# EAGLE schematic Custom_DUE (EAGLE 7.1.0)
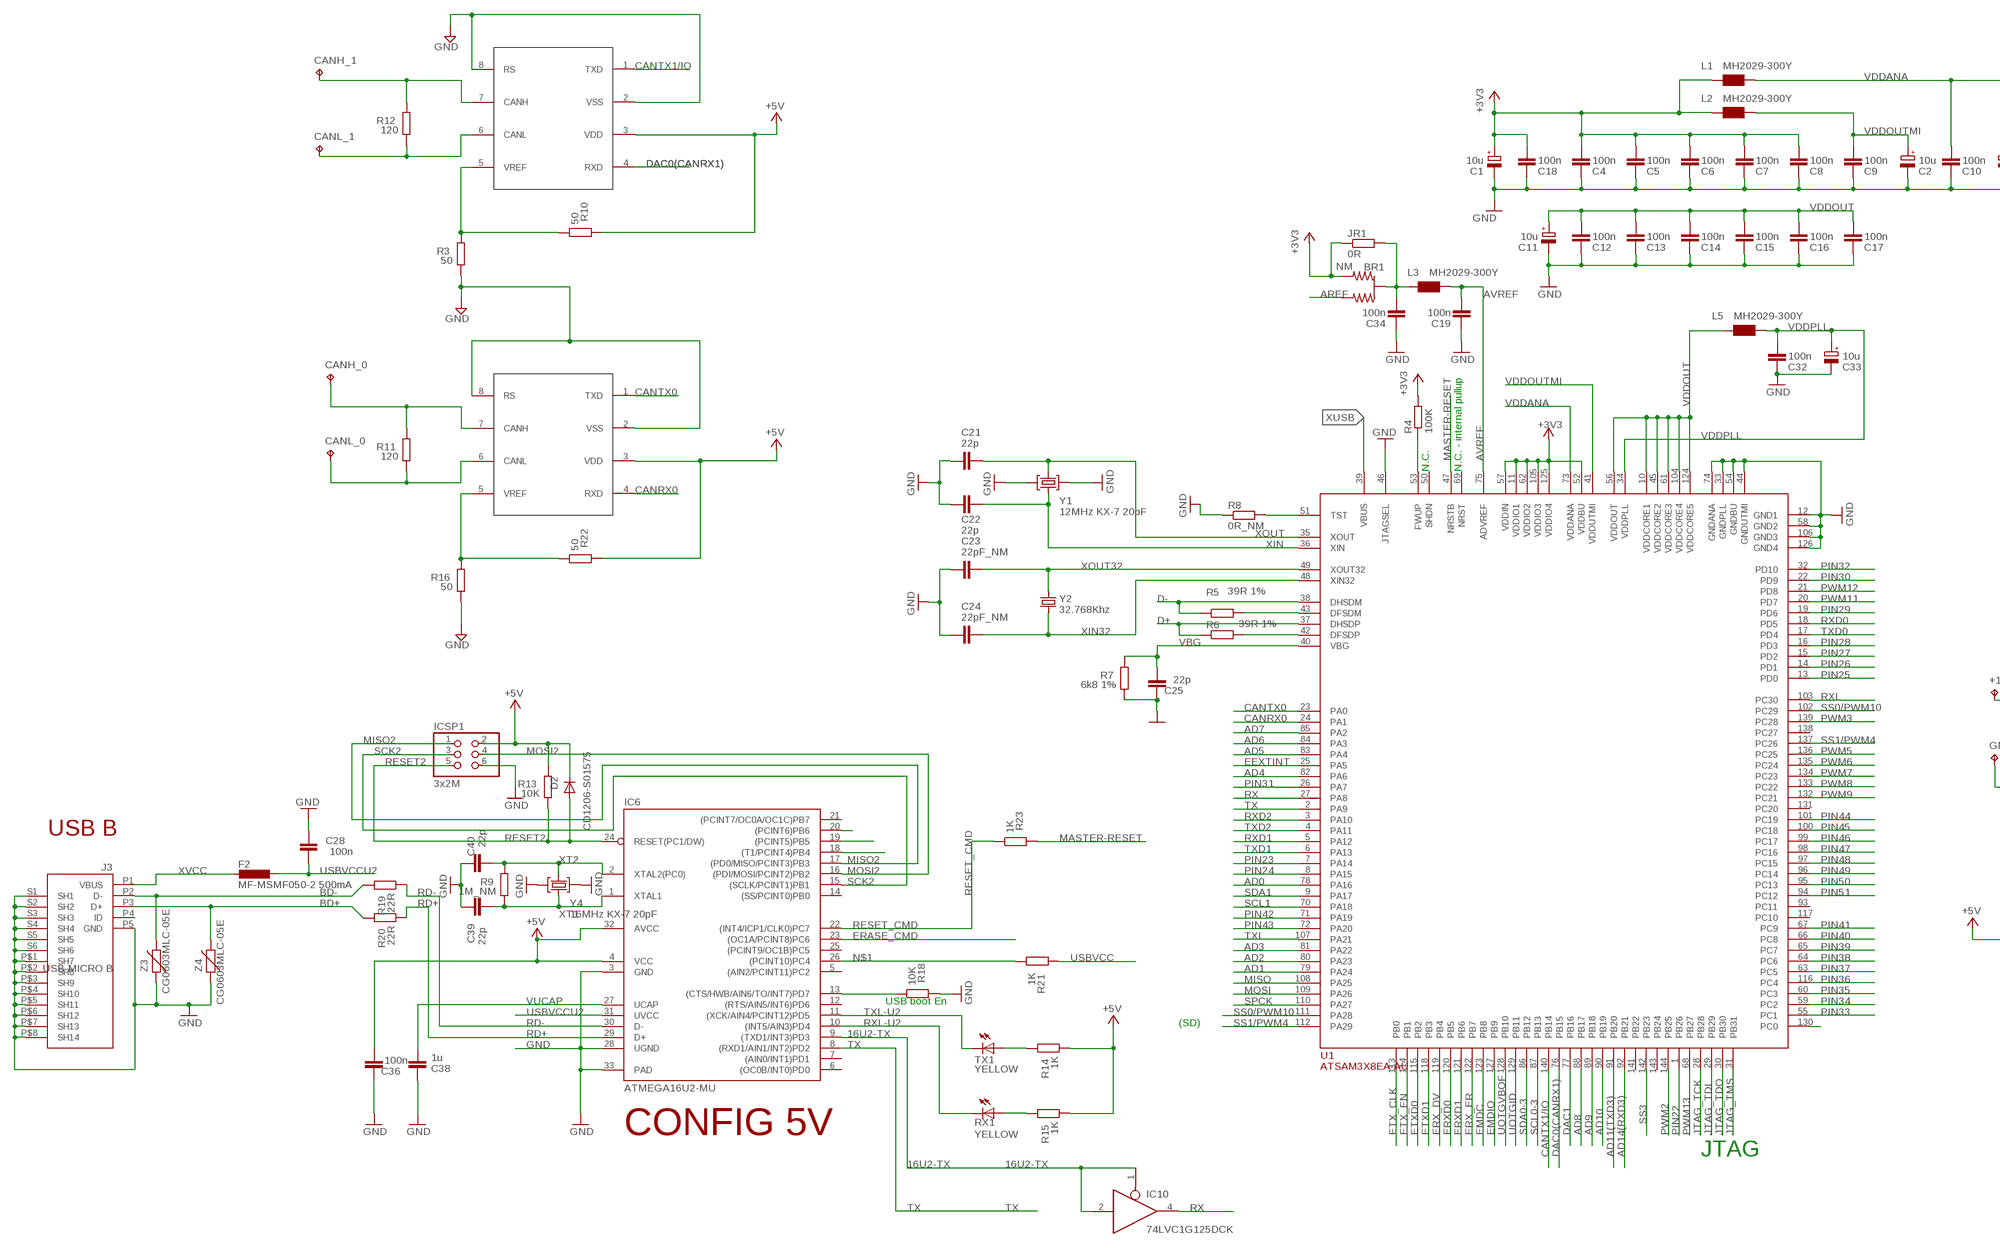
[diagram p0: schematic, sheet 1, part 1 of 2]
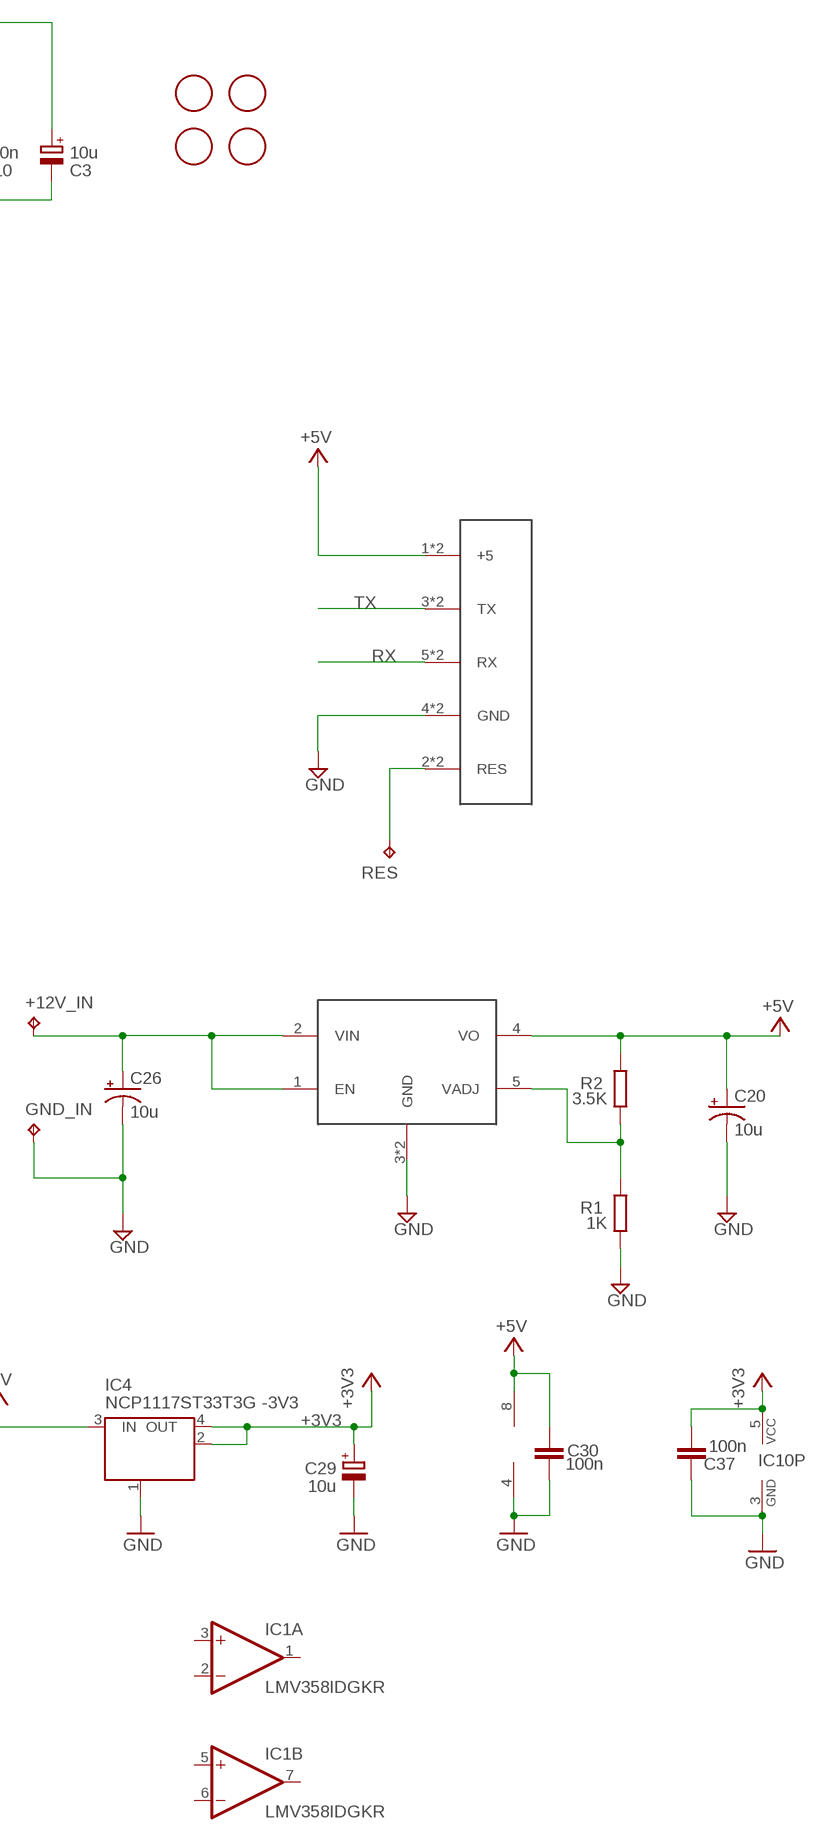
[diagram p1: schematic, sheet 1, part 2 of 2]

## Parts
+12V_IN  TPPAD1-20  [P1-20]
BR1  NM  J0402  [J0402]
C1  10u  CPOL-EUSMCB  [SMC_B]
C2  10u  CPOL-EUSMCB  [SMC_B]
C3  10u  CPOL-EUSMCB  [SMC_B]
C4  100n  C-EUC0402  [C0402]
C5  100n  C-EUC0402  [C0402]
C6  100n  C-EUC0402  [C0402]
C7  100n  C-EUC0402  [C0402]
C8  100n  C-EUC0402  [C0402]
C9  100n  C-EUC0402  [C0402]
C10  100n  C-EUC0402  [C0402]
C11  10u  CPOL-EUSMCB  [SMC_B]
C12  100n  C-EUC0402  [C0402]
C13  100n  C-EUC0402  [C0402]
C14  100n  C-EUC0402  [C0402]
C15  100n  C-EUC0402  [C0402]
C16  100n  C-EUC0402  [C0402]
C17  100n  C-EUC0402  [C0402]
C18  100n  C-EUC0402  [C0402]
C19  100n  C-EUC0402  [C0402]
C20  10u  CPOL-US153CLV-0405  [153CLV-0405]
C21  22p  C-EUC0402  [C0402]
C22  22p  C-EUC0402  [C0402]
C23  22pF_NM  C-EUC0402  [C0402]
C24  22pF_NM  C-EUC0402  [C0402]
C25  22p  C-EUC0402  [C0402]
C26  10u  CPOL-US153CLV-0405  [153CLV-0405]
C28  100n  C-EUC0402  [C0402]
C29  10u  CPOL-EUSMCB  [SMC_B]
C30  100n  C-EUC0402  [C0402]
C32  100n  C-EUC0402  [C0402]
C33  10u  CPOL-EUSMCB  [SMC_B]
C34  100n  C-EUC0402  [C0402]
C36  100n  C-EUC0402  [C0402]
C37  100n  C-EUC0402  [C0402]
C38  1u  C-EUC0402  [C0402]
C39  22p  C-EUC0402  [C0402]
C40  22p  C-EUC0402  [C0402]
CANH_0  TPPAD1-20  [P1-20]
CANH_1  TPPAD1-20  [P1-20]
CANL_0  TPPAD1-20  [P1-20]
CANL_1  TPPAD1-20  [P1-20]
D2  CD1206-S01575  DIODE-MINIMELF  [MINIMELF]
F2  MF-MSMF050-2 500mA  L-EUL1812  [L1812]
FID1  FIDUCIALMOUNT  [FIDUCIA-MOUNT]
FID2  FIDUCIALMOUNT  [FIDUCIA-MOUNT]
FID3  FIDUCIALMOUNT  [FIDUCIA-MOUNT]
FID4  FIDUCIALMOUNT  [FIDUCIA-MOUNT]
GND_IN  TPPAD1-20  [P1-20]
IC1  LMV358IDGKR  LMV358MMX  [MSOP08]
IC4  NCP1117ST33T3G -3V3  MC33269ST-3.3T3  [SOT223]
IC6  ATMEGA16U2-MU  [MLF32]
IC10  74LVC1G125DCK  [SC70-5]
ICSP1  3x2M  PINHD-2X3  [2X03]
J3  USB-MICRO B  MYCON2_USB-MINI-B  [CON2_USB_MICRO_B_AT]
JR1  0R  R-EU_R0402  [R0402]
L1  MH2029-300Y  WE-CBF_0805  [0805]
L2  MH2029-300Y  WE-CBF_0805  [0805]
L3  MH2029-300Y  WE-CBF_0805  [0805]
L5  MH2029-300Y  WE-CBF_0805  [0805]
R1  1K  R-EU_R0402  [R0402]
R2  3.5K  R-EU_R0402  [R0402]
R3  50  R-EU_R0402  [R0402]
R4  100K  R-EU_R0402  [R0402]
R5  39R 1%  R-EU_R0402  [R0402]
R6  39R 1%  R-EU_R0402  [R0402]
R7  6k8 1%  R-EU_R0603  [R0603-ROUND]
R8  0R_NM  R-EU_R0402  [R0402]
R9  1M_NM  R-EU_R0402  [R0402]
R10  50  R-EU_R0402  [R0402]
R11  120  R-EU_R0402  [R0402]
R12  120  R-EU_R0402  [R0402]
R13  10K  R-EU_R0402  [R0402]
R14  1K  R-EU_R0402  [R0402]
R15  1K  R-EU_R0402  [R0402]
R16  50  R-EU_R0402  [R0402]
R18  10K  R-EU_R0402  [R0402]
R19  22R  R-EU_R0402  [R0402]
R20  22R  R-EU_R0402  [R0402]
R21  1K  R-EU_R0402  [R0402]
R22  50  R-EU_R0402  [R0402]
R23  1K  R-EU_R0402  [R0402]
RES  TPPAD1-20  [P1-20]
RX1  YELLOW  LEDCHIP-LED0805  [CHIP-LED0805]
TX1  YELLOW  LEDCHIP-LED0805  [CHIP-LED0805]
U1  ATSAM3X8EA-AU  ATSAM3X/AAU  [LQFP144]
U2  MCP2551  [SOIC8]
U4  MCP2551  [SOIC8]
U$1  TLF1963TBATMA1  TLF1963  [DPAK]
U$3  LCD_DISPLAY  [FE05-2]
Y1  12MHz KX-7 20pF  CRYSTAL-3.2-2.5  [CRYSTAL-3.2-2.5]
Y2  32.768Khz  RESONATOR_EPSON_FC_145  [RESONATOR_EPSON_FC_145]
Y4  16MHz KX-7 20pF  CRYSTAL-3.2-2.5  [CRYSTAL-3.2-2.5]
Z3  CG0603MLC-05E  VARISTORCN0603  [CT/CN0603]
Z4  CG0603MLC-05E  VARISTORCN0603  [CT/CN0603]

## Nets
8PB4: IC6.18((T1/PCINT4)PB4)
8PB5: IC6.19((PCINT5)PB5)
8PB6: IC6.20((PCINT6)PB6)
16U2-TX: IC6.9((TXD1/INT3)PD3) IC10.1(OE) IC10.2(I)
+3V3: BR1.3 C1.+ C4.2 C5.2 C6.2 C7.2 C8.2 C18.2 C29.+ C37.1 IC4.2(OUT) IC4.4(OUT) IC10.5(VCC) JR1.1 L1.1 L2.1 R4.2 U1.11(VDDIO1) U1.52(VDDBU) U1.57(VDDIN) U1.62(VDDIO2) U1.105(VDDIO3) U1.125(VDDIO4)
+5V: C20.+ C30.2 C36.1 D2.C IC1.8(P:V+) IC4.3(IN) IC6.4(VCC) IC6.32(AVCC) ICSP1.2 R2.2 R10.2 R13.2 R14.1 R15.1 R22.2 U2.3(VDD) U4.3(VDD) U$1.4(VO) U$3.1(+5) U$3.10(+5)
AD0: U1.78(PA16)
AD1: U1.79(PA24)
AD2: U1.80(PA23)
AD3: U1.81(PA22)
AD4: U1.82(PA6)
AD5: U1.83(PA4)
AD6: U1.84(PA3)
AD7: U1.85(PA2)
AD8: U1.88(PB17)
AD9: U1.89(PB18)
AD10: U1.90(PB19)
AD11(TXD3): U1.91(PB20)
AD14(RXD3): U1.92(PB21)
AREF: BR1.1
AVREF: C19.2 L3.2 U1.75(ADVREF)
AVREFL: BR1.2(C) C34.2 JR1.2 L3.1
BD+ [USB]: J3.P3(D+) R20.2 Z4.2
BD- [USB]: J3.P2(D-) R19.2 Z3.2
CANRX0: U1.24(PA1) U4.4(RXD)
CANTX0: U1.23(PA0) U4.1(TXD)
CANTX1/IO: U1.140(PB14) U2.1(TXD)
D+ [USBpair]: R6.1 U1.37(DHSDP)
D- [USBpair]: R5.1 U1.38(DHSDM)
DAC0(CANRX1): U1.76(PB15) U2.4(RXD)
DAC1: U1.77(PB16)
DTR: IC6.13((CTS/HWB/AIN6/TO/INT7)PD7) R18.1
EEXTINT: U1.25(PA5)
EMDC: U1.123(PB8)
EMDIO: U1.127(PB9)
ERASE_CMD: IC6.23((OC1A/PCINT8)PC6)
ERASE_S: U1.130(PC0)
ERX_DV: U1.119(PB4)
ERX_ER: U1.122(PB7)
ERXD0: U1.120(PB5)
ERXD1: U1.121(PB6)
ETX_CLK: U1.113(PB0)
ETX_EN: U1.114(PB1)
ETXD0: U1.115(PB2)
ETXD1: U1.118(PB3)
GND: C1.- C2.- C3.- C4.1 C5.1 C6.1 C7.1 C8.1 C9.1 C10.1 C11.- C12.1 C13.1 C14.1 C15.1 C16.1 C17.1 C18.1 C19.1 C20.- C21.2 C22.2 C23.2 C24.2 C25.2 C26.- C28.2 C29.- C30.1 C32.1 C33.- C34.1 C36.2 C37.2 C38.2 C39.2 C40.2 GND_IN.TP IC1.4(P:V-) IC4.1(GND/ADJ) IC6.3(GND) IC6.28(UGND) IC6.33(PAD) IC10.3(GND) ICSP1.6 J3.P5(GND) J3.P$1(SH7) J3.P$2(SH8) J3.P$3(SH9) J3.P$4(SH10) J3.P$5(SH11) J3.P$6(SH12) J3.P$7(SH13) J3.P$8(SH14) J3.S1(SH1) J3.S2(SH2) J3.S3(SH3) J3.S4(SH4) J3.S5(SH5) J3.S6(SH6) R1.1 R3.1 R7.1 R8.1 R16.1 R18.2 U1.12(GND1) U1.33(GNDPLL) U1.44(GNDUTMI) U1.46(JTAGSEL) U1.54(GNDBU) U1.58(GND2) U1.74(GNDANA) U1.106(GND3) U1.126(GND4) U2.2(VSS) U2.8(RS) U4.2(VSS) U4.8(RS) U$1.3(GND) U$1.6(GND) U$3.4(GND) U$3.7(GND) Y1.2(GND) Y1.4(GND) Y4.2(GND) Y4.4(GND) Z3.1 Z4.1
JTAG_TCK: U1.28(PB28)
JTAG_TDI: U1.29(PB29)
JTAG_TDO: U1.30(PB30)
JTAG_TMS: U1.31(PB31)
MASTER-RESET: R23.2 U1.47(NRSTB)
MISO: U1.108(PA25)
MISO2: IC6.17((PD0/MISO/PCINT3)PB3) ICSP1.1
MOSI: U1.109(PA26)
MOSI2: IC6.16((PDI/MOSI/PCINT2)PB2) ICSP1.4
N$1: IC6.26((PCINT10)PC4) R21.1
N$2: +12V_IN.TP C26.+ U$1.1(EN) U$1.2(VIN)
N$3: R3.2 R10.1 U2.5(VREF)
N$4: R15.2 RX1.A
N$5: R8.2 U1.51(TST)
N$6: R1.2 R2.1 U$1.5(VADJ)
N$7: R4.1 U1.53(FWUP)
N$8: R16.2 R22.1 U4.5(VREF)
N$9: CANH_0.TP R11.2 U4.7(CANH)
N$10: CANL_0.TP R11.1 U4.6(CANL)
N$11: R5.2 U1.43(DFSDM)
N$12: R6.2 U1.42(DFSDP)
N$13: CANH_1.TP R12.2 U2.7(CANH)
N$14: R14.2 TX1.A
N$15: CANL_1.TP R12.1 U2.6(CANL)
N$16: RES.TP U$3.2(RES) U$3.9(RES)
PIN22: U1.1(PB26)
PIN23: U1.7(PA14)
PIN24: U1.8(PA15)
PIN25: U1.13(PD0)
PIN26: U1.14(PD1)
PIN27: U1.15(PD2)
PIN28: U1.16(PD3)
PIN29: U1.19(PD6)
PIN30: U1.22(PD9)
PIN31: U1.26(PA7)
PIN32: U1.32(PD10)
PIN33: U1.55(PC1)
PIN34: U1.59(PC2)
PIN35: U1.60(PC3)
PIN36: U1.116(PC4)
PIN37: U1.63(PC5)
PIN38: U1.64(PC6)
PIN39: U1.65(PC7)
PIN40: U1.66(PC8)
PIN41: U1.67(PC9)
PIN42: U1.71(PA19)
PIN43: U1.72(PA20)
PIN44: U1.101(PC19)
PIN45: U1.100(PC18)
PIN46: U1.99(PC17)
PIN47: U1.98(PC16)
PIN48: U1.97(PC15)
PIN49: U1.96(PC14)
PIN50: U1.95(PC13)
PIN51: U1.94(PC12)
PWM2: U1.144(PB25)
PWM3: U1.139(PC28)
PWM5: U1.136(PC25)
PWM6: U1.135(PC24)
PWM7: U1.134(PC23)
PWM8: U1.133(PC22)
PWM9: U1.132(PC21)
PWM11: U1.20(PD7)
PWM12: U1.21(PD8)
PWM13: U1.68(PB27)
RD+: IC6.29(D+) R20.1
RD-: IC6.30(D-) R19.1
RESET2: D2.A IC6.24(RESET(PC1/DW)) ICSP1.5 R13.1
RESET_CMD: IC6.22((INT4/ICP1/CLK0)PC7) R23.1
RX: IC10.4(O) U1.27(PA8) U$3.5(RX) U$3.6(RX)
RXD0: U1.18(PD5)
RXD1: U1.5(PA12)
RXD2: U1.3(PA10)
RXL: U1.103(PC30)
RXL-U2: IC6.10((INT5/AIN3)PD4) RX1.C
SCK2: IC6.15((SCLK/PCINT1)PB1) ICSP1.3
SCL0-3: U1.87(PB13)
SCL1: U1.70(PA18)
SDA0-3: U1.86(PB12)
SDA1: U1.9(PA17)
SPCK: U1.110(PA27)
SS0/PWM10: U1.102(PC29) U1.111(PA28)
SS1/PWM4: U1.112(PA29) U1.137(PC26)
SS3: U1.142(PB23)
TX: IC6.8((RXD1/AIN1/INT2)PD2) U1.2(PA9) U$3.3(TX) U$3.8(TX)
TXD0: U1.17(PD4)
TXD1: U1.6(PA13)
TXD2: U1.4(PA11)
TXL: U1.107(PA21)
TXL-U2: IC6.11((XCK/AIN4/PCINT12)PD5) TX1.C
UOTGID: U1.129(PB11)
UOTGVBOF: U1.128(PB10)
USBVCC: R21.2
USBVCCU2: C28.1 F2.1 IC6.31(UVCC)
VBG: C25.1 R7.2 U1.40(VBG)
VDDANA: C3.+ C10.2 L1.2 U1.73(VDDANA)
VDDOUT: C11.+ C12.2 C13.2 C14.2 C15.2 C16.2 C17.2 L5.1 U1.10(VDDCORE1) U1.45(VDDCORE2) U1.56(VDDOUT) U1.61(VDDCORE3) U1.104(VDDCORE4) U1.124(VDDCORE5)
VDDOUTMI: C2.+ C9.2 L2.2 U1.41(VDDUTMI)
VDDPLL: C32.2 C33.+ L5.2 U1.34(VDDPLL)
VUCAP: C38.1 IC6.27(UCAP)
XIN: C22.1 U1.36(XIN) Y1.1(C1)
XIN32: C24.1 U1.48(XIN32) Y2.P$2
XOUT: C21.1 U1.35(XOUT) Y1.3(C2)
XOUT32: C23.1 U1.49(XOUT32) Y2.P$1
XT1: C39.1 IC6.1(XTAL1) R9.1 Y4.1(C1)
XT2: C40.1 IC6.2(XTAL2(PC0)) R9.2 Y4.3(C2)
XUSB [usbvcc]: U1.39(VBUS)
XVCC [usbvcc]: F2.2 J3.P1(VBUS)
Unconnected: IC1.1(A:OUT) IC1.2(A:-IN) IC1.3(A:+IN) IC1.5(B:+IN) IC1.6(B:-IN) IC1.7(B:OUT) IC6.5((AIN2/PCINT11)PC2) IC6.6((OC0B/INT0)PD0) IC6.7((AIN0/INT1)PD1) IC6.12((RTS/AIN5/INT6)PD6) IC6.14((SS/PCINT0)PB0) IC6.21((PCINT7/OC0A/OC1C)PB7) IC6.25((PCINT9/OC1B)PC5) J3.P4(ID) U1.50(SHDN) U1.69(NRST) U1.93(PC11) U1.117(PC10) U1.131(PC20) U1.138(PC27) U1.141(PB22) U1.143(PB24)

## Notes on the sheet
- N.C. | N.C. - internal pullup
- USB B
- USB boot En
- (SD)
- CONFIG 5V
- JTAG

## Library data of the parts
+12V_IN CANH_0 CANH_1 CANL_0 CANL_1 GND_IN RES = testpad:TP: Test pad
BR1 = bibaja:J: Three terminal jumper made from two 0402, 0603, 0805, etc.
C1-C3 C11 C29 C33 = rcl:CPOL-EU: POLARIZED CAPACITOR, European symbol
C4-C10 C12-C19 C21-C25 C28 C30 C32 C34 C36-C40 = SmartPrj:C-EU: CAPACITOR, European symbol
C20 C26 = Dash parts:CPOL-US: POLARIZED CAPACITOR, American symbol; EEE-FPV100UAR: 10u
D2 = diode:DIODE-: DIODE
F2 = rcl:L-EU: INDUCTOR, European symbol
FID1-FID4 = SmartPrj:FIDUCIALMOUNT
IC1 = linear:LMV358?*: Dual General Purpose, Low Voltage, Rail-to-Rail Output Operational Amplifiers Source: http://www.national.com/mpf/LM/LMV321.html http://www.national.com/dt/lmv_qual.pdf
IC4 = linear:MC33269ST*: Adjustable Output Low Dropout Voltage Regulator 800 mA Source: http://www.onsemi.com/pub/Collateral/MC33269-D.PDF
IC6 = SmartPrj:ATMEGA16U2-
IC10 = 74xx-little-us:74*1G125: Single Bus Buffer Gate with 3-State Output
ICSP1 = SmartPrj:PINHD-2X3: PIN HEADER
J3 = SmartPrj:MYCON2_USB-MINI-B
JR1 R3-R16 R18-R23 = SmartPrj:R-EU_: RESISTOR, European symbol
L1-L3 L5 = wuerth-elektronik:WE-CBF: SMD EMI Suppression Ferrite Beads - excellent anti-EMI properties - low DCR - impedances till 3000 ohms - rated current up to 6 A
R1 = SmartPrj:R-EU_: RESISTOR, European symbol; SMD: 1K, 1%
R2 = SmartPrj:R-EU_: RESISTOR, European symbol; SMD: 3.5K, 1%
RX1 TX1 = led:LED: LED OSRAM: - CHIPLED LG R971, LG N971, LY N971, LG Q971, LY Q971, LO R971, LY R971 LH N974, LH R974 LS Q976, LO Q976, LY Q976 LO Q996 - Hyper CHIPLED LW Q18S LB Q993, LB Q99A, LB R99A - SideLED LS A670, LO A670, LY A670, LG A670, LP A670 LB A673, LV A673, LT A673, LW A673 LH A674 LY A675 LS A676, LA A676, LO A676, LY A676, LW A676 LS A679, LY A679, LG A679 - Hyper Micro SIDELED® LS Y876, LA Y876, LO Y876, LY Y876 LT Y87S - SmartLED LW L88C, LW L88S LB L89C, LB L89S, LG L890 LS L89K, LO L89K, LY L89K LS L896, LA L896, LO L896, LY L896 - TOPLED LS T670, LO T670, LY T670, LG T670, LP T670 LSG T670, LSP T670, LSY T670, LOP T670, LYG T670 LG T671, LOG T671, LSG T671 LB T673, LV T673, LT T673, LW T673 LH T674 LS T676, LA T676, LO T676, LY T676, LB T676, LH T676, LSB T676, LW T676 LB T67C, LV T67C, LT T67C, LS T67K, LO T67K, LY T67K, LW E67C LS E67B, LA E67B, LO E67B, LY E67B, LB E67C, LV E67C, LT E67C LW T67C LS T679, LY T679, LG T679 LS T770, LO T770, LY T770, LG T770, LP T770 LB T773, LV T773, LT T773, LW T773 LH T774 LS E675, LA E675, LY E675, LS T675 LS T776, LA T776, LO T776, LY T776, LB T776 LHGB T686 LT T68C, LB T68C - Hyper Mini TOPLED® LB M676 - Mini TOPLED Santana® LG M470 LS M47K, LO M47K, LY M47K Source: http://www.osram.convergy.de LUXEON: - LUMILED® LXK2-PW12-R00, LXK2-PW12-S00, LXK2-PW14-U00, LXK2-PW14-V00 LXK2-PM12-R00, LXK2-PM12-S00, LXK2-PM14-U00 LXK2-PE12-Q00, LXK2-PE12-R00, LXK2-PE12-S00, LXK2-PE14-T00, LXK2-PE14-U00 LXK2-PB12-K00, LXK2-PB12-L00, LXK2-PB12-M00, LXK2-PB14-N00, LXK2-PB14-P00, LXK2-PB14-Q00 LXK2-PR12-L00, LXK2-PR12-M00, LXK2-PR14-Q00, LXK2-PR14-R00 LXK2-PD12-Q00, LXK2-PD12-R00, LXK2-PD12-S00 LXK2-PH12-R00, LXK2-PH12-S00 LXK2-PL12-P00, LXK2-PL12-Q00, LXK2-PL12-R00 Source: www.luxeon.com KINGBRIGHT: KA-3528ASYC Source: www.kingbright.com
U1 = SmartPrj:ATSAM3X/A
U2 U4 = Dash parts:MCP2551
U$1 = Dash parts:TLF1963
U$3 = Dash parts:LCD_DISPLAY
Y1 Y4 = SmartPrj:CRYSTAL-3.2-2.5
Y2 = Arduino_Wifi_shield_v018_tG:RESONATOR_EPSON_FC_145
Z3 Z4 = varistor:VARISTOR: VARISTOR

## Net classes
1 USB: width 0.203 mm, drill 0.406 mm, clearance 0.203 mm
3 usbvcc: width 0.203 mm, drill 0.406 mm, clearance 0.203 mm
4 USBpair: width 0.254 mm, drill 0.406 mm, clearance 0.61 mm